# EAGLE design Clock_rev1 (EAGLE 9.6.2)
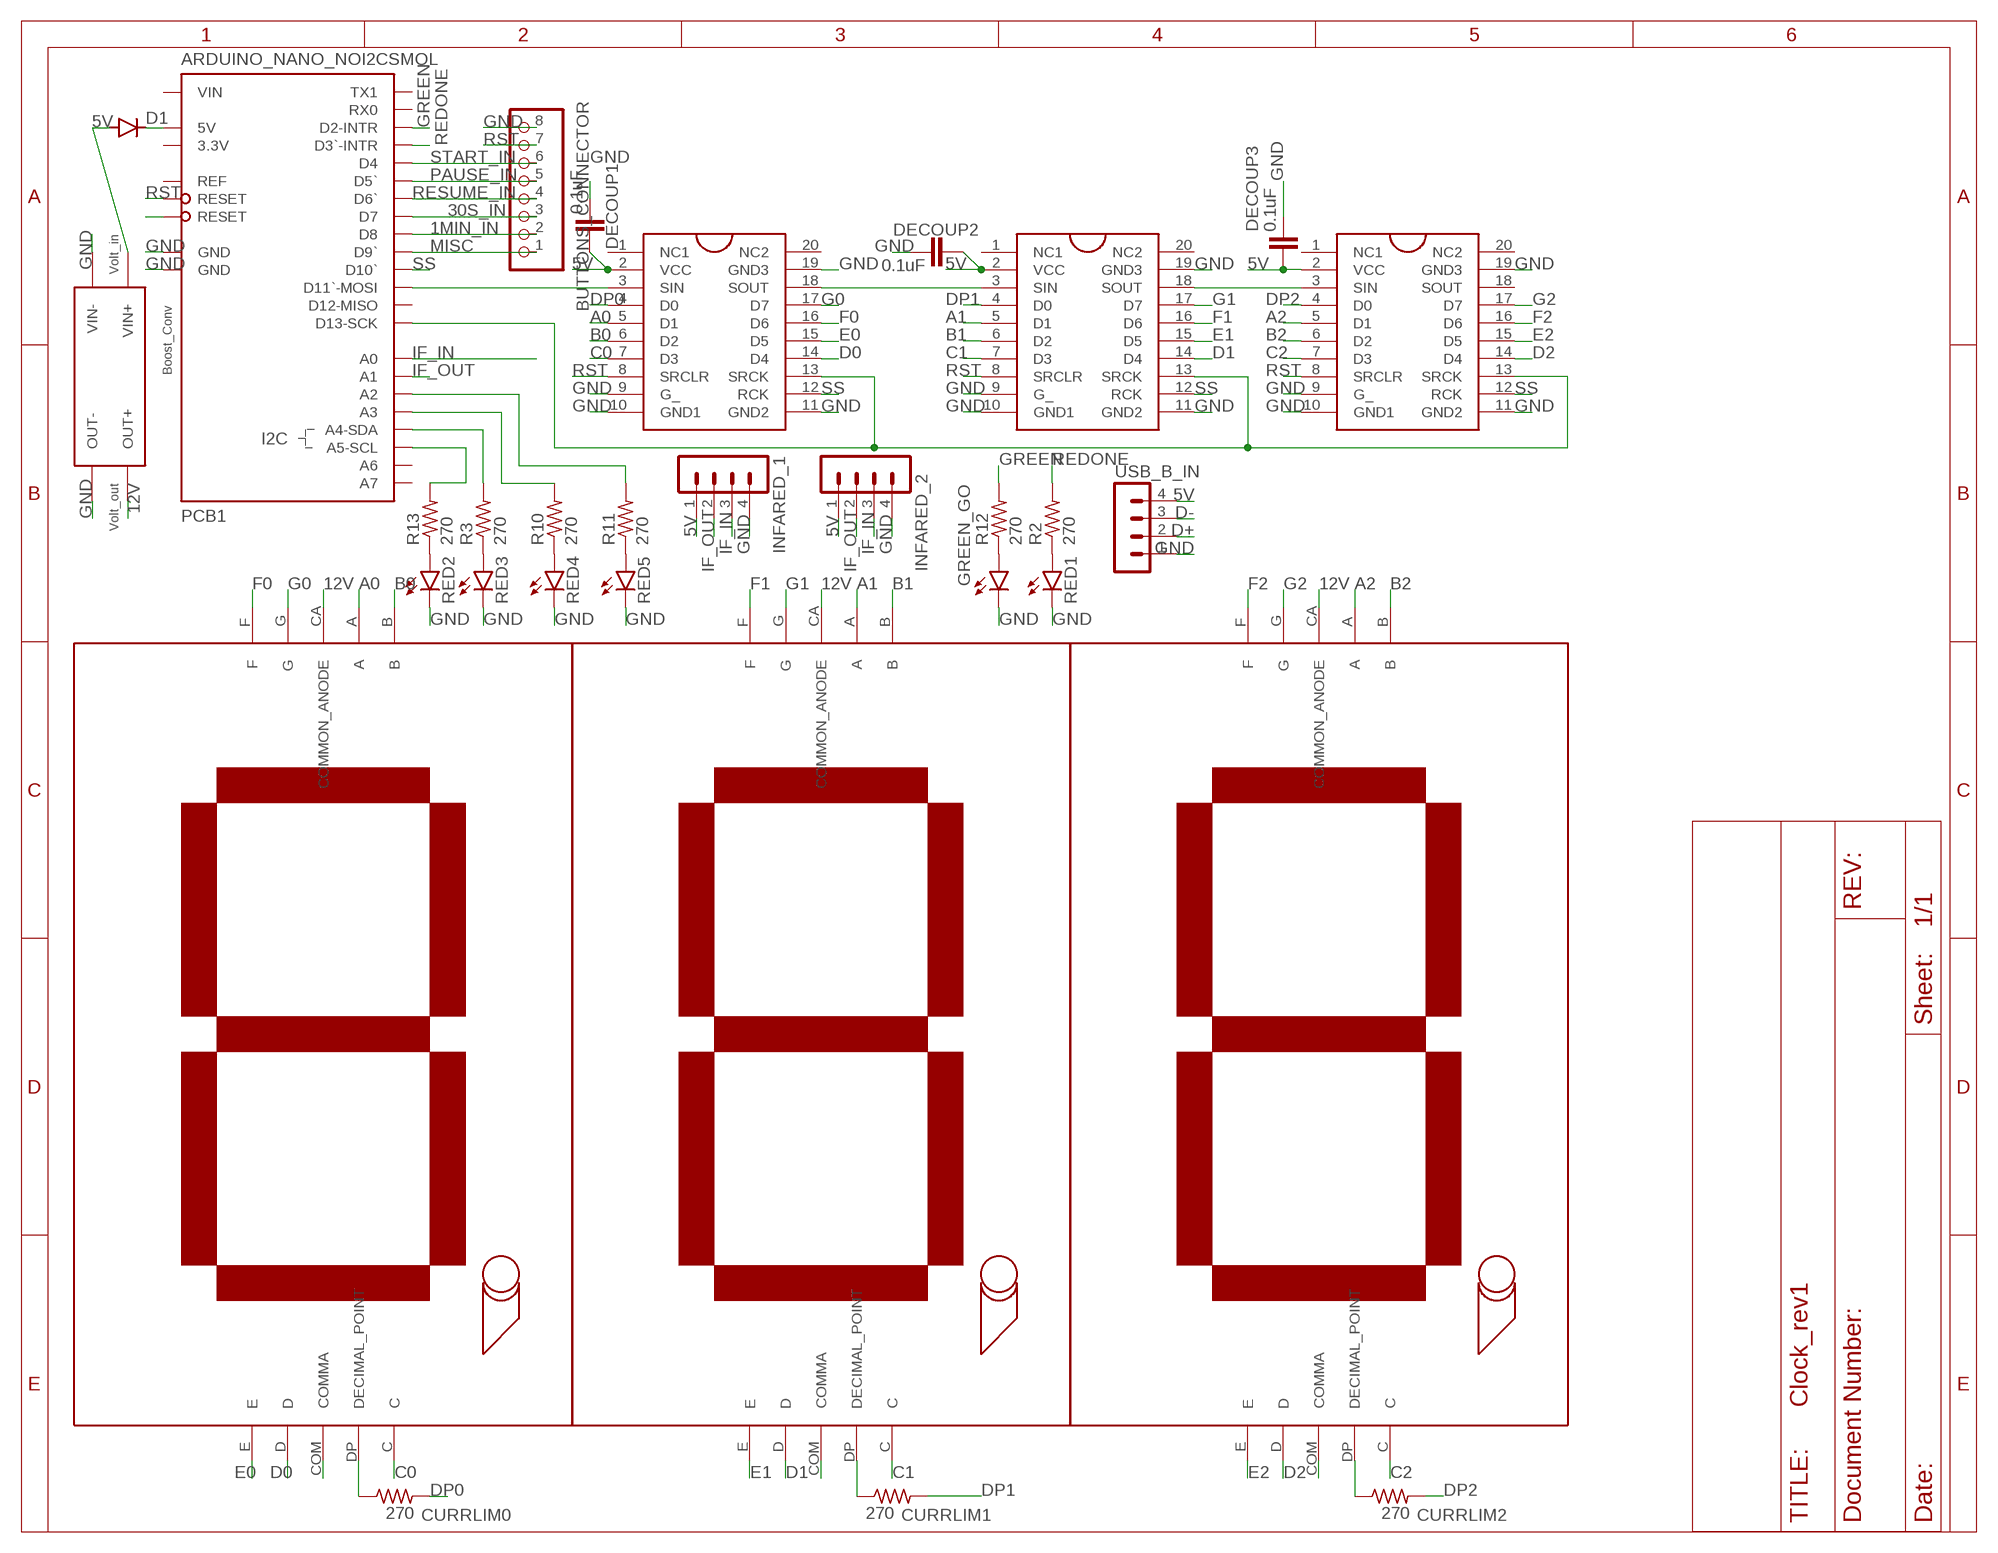
[diagram p0: schematic, sheet 1]

## Parts
BUTTONS_CONNECTOR  PINHD-1X8/90  [1X08/90]
CURRLIM0  270  R-US_0207/10  [0207/10]
CURRLIM1  270  R-US_0207/10  [0207/10]
CURRLIM2  270  R-US_0207/10  [0207/10]
D1  1N4148DO35-7  [DO35-7]
DECOUP1  0.1uF  C2.5/2  [C2.5-2]
DECOUP2  0.1uF  C2.5/2  [C2.5-2]
DECOUP3  0.1uF  C2.5/2  [C2.5-2]
GREEN_GO  LED5MM  [LED5MM]
INFARED_1  MA04-1  [MA04-1]
INFARED_2  MA04-1  [MA04-1]
MINUTES  7SEG_LED_A-3001SR  [7SEG_LED]
PCB1  ARDUINO_NANO_NOI2CSMOL  [ARDUINO_NANO_SMOL]
R2  270  R-US_0207/10  [0207/10]
R3  270  R-US_0207/10  [0207/10]
R10  270  R-US_0207/10  [0207/10]
R11  270  R-US_0207/10  [0207/10]
R12  270  R-US_0207/10  [0207/10]
R13  270  R-US_0207/10  [0207/10]
RED1  LED5MM  [LED5MM]
RED2  LED5MM  [LED5MM]
RED3  LED5MM  [LED5MM]
RED4  LED5MM  [LED5MM]
RED5  LED5MM  [LED5MM]
SECONDS_ONES  7SEG_LED_A-3001SR  [7SEG_LED]
SECONDS_TENS  7SEG_LED_A-3001SR  [7SEG_LED]
SP0  SHIFT_REGISTER_TPIC6C595  [SHIFT_REGISTER]
SP1  SHIFT_REGISTER_TPIC6C595  [SHIFT_REGISTER]
SP2  SHIFT_REGISTER_TPIC6C595  [SHIFT_REGISTER]
U$4  BOOST_CONV  [BOOST_CONV]
USB_B_IN  MA04-1  [MA04-1]

## Nets
1MIN_IN: BUTTONS_CONNECTOR.2 PCB1.D8
5V: D1.A DECOUP1.2 DECOUP2.2 DECOUP3.2 INFARED_1.1 INFARED_2.1 SP0.2(VCC) SP1.2(VCC) SP2.2(VCC) U$4.P$2(VIN+) USB_B_IN.4
12V: MINUTES.CA(COMMON_ANODE) SECONDS_ONES.CA(COMMON_ANODE) SECONDS_TENS.CA(COMMON_ANODE) U$4.P$3(OUT+)
30S_IN: BUTTONS_CONNECTOR.3 PCB1.D7
A0: MINUTES.A SP0.5(D1)
A1: SECONDS_TENS.A SP1.5(D1)
A2: SECONDS_ONES.A SP2.5(D1)
B0: MINUTES.B SP0.6(D2)
B1: SECONDS_TENS.B SP1.6(D2)
B2: SECONDS_ONES.B SP2.6(D2)
C0: MINUTES.C SP0.7(D3)
C1: SECONDS_TENS.C SP1.7(D3)
C2: SECONDS_ONES.C SP2.7(D3)
D0: MINUTES.D SP0.14(D4)
D1: SECONDS_TENS.D SP1.14(D4)
D2: SECONDS_ONES.D SP2.14(D4)
D+: USB_B_IN.2
D-: USB_B_IN.3
DP0: CURRLIM0.2 SP0.4(D0)
DP1: CURRLIM1.2 SP1.4(D0)
DP2: CURRLIM2.2 SP2.4(D0)
E0: MINUTES.E SP0.15(D5)
E1: SECONDS_TENS.E SP1.15(D5)
E2: SECONDS_ONES.E SP2.15(D5)
F0: MINUTES.F SP0.16(D6)
F1: SECONDS_TENS.F SP1.16(D6)
F2: SECONDS_ONES.F SP2.16(D6)
G0: MINUTES.G SP0.17(D7)
G1: SECONDS_TENS.G SP1.17(D7)
G2: SECONDS_ONES.G SP2.17(D7)
GND: BUTTONS_CONNECTOR.8 DECOUP1.1 DECOUP2.1 DECOUP3.1 GREEN_GO.K(C) INFARED_1.4 INFARED_2.4 PCB1.GND PCB1.GND@2(GND) RED1.K(C) RED2.K(C) RED3.K(C) RED4.K(C) RED5.K(C) SP0.9(G_) SP0.10(GND1) SP0.11(GND2) SP0.19(GND3) SP1.9(G_) SP1.10(GND1) SP1.11(GND2) SP1.19(GND3) SP2.9(G_) SP2.10(GND1) SP2.11(GND2) SP2.19(GND3) U$4.P$1(VIN-) U$4.P$4(OUT-) USB_B_IN.1
GREEN: PCB1.D2(D2-INTR) R12.2
IF_IN: INFARED_1.3 INFARED_2.3 PCB1.A0
IF_OUT: INFARED_1.2 INFARED_2.2 PCB1.A1
MISC: BUTTONS_CONNECTOR.1 PCB1.D9(D9`)
N$1: PCB1.D11(D11`-MOSI) SP0.3(SIN)
N$2: D1.C PCB1.5V
N$3: CURRLIM0.1 MINUTES.DP(DECIMAL_POINT)
N$4: CURRLIM1.1 SECONDS_TENS.DP(DECIMAL_POINT)
N$5: CURRLIM2.1 SECONDS_ONES.DP(DECIMAL_POINT)
N$6: SP0.18(SOUT) SP1.3(SIN)
N$7: SP1.18(SOUT) SP2.3(SIN)
N$8: PCB1.D13(D13-SCK) SP0.13(SRCK) SP1.13(SRCK) SP2.13(SRCK)
N$9: PCB1.RESET@2(RESET)
N$11: R2.1 RED1.A
N$12: R13.1 RED2.A
N$13: R3.1 RED3.A
N$14: R10.1 RED4.A
N$15: R11.1 RED5.A
N$16: GREEN_GO.A R12.1
N$19: PCB1.A5(A5-SCL) R13.2
N$20: PCB1.A4(A4-SDA) R3.2
N$21: PCB1.A3 R10.2
N$22: PCB1.A2 R11.2
N$36: SECONDS_ONES.COM(COMMA)
N$40: SECONDS_TENS.COM(COMMA)
N$44: MINUTES.COM(COMMA)
PAUSE_IN: BUTTONS_CONNECTOR.5 PCB1.D5(D5`)
REDONE: PCB1.D3(D3`-INTR) R2.2
RESUME_IN: BUTTONS_CONNECTOR.4 PCB1.D6(D6`)
RST: BUTTONS_CONNECTOR.7 PCB1.RESET SP0.8(SRCLR) SP1.8(SRCLR) SP2.8(SRCLR)
SS: PCB1.D10(D10`) SP0.12(RCK) SP1.12(RCK) SP2.12(RCK)
START_IN: BUTTONS_CONNECTOR.6 PCB1.D4
Unconnected: PCB1.3V3(3.3V) PCB1.A6 PCB1.A7 PCB1.D12(D12-MISO) PCB1.REF PCB1.RX0 PCB1.TX1 PCB1.VIN SP0.1(NC1) SP0.20(NC2) SP1.1(NC1) SP1.20(NC2) SP2.1(NC1) SP2.18(SOUT) SP2.20(NC2)

## Library data of the parts
BUTTONS_CONNECTOR = pinhead:PINHD-1X8: PIN HEADER
CURRLIM0 CURRLIM1 CURRLIM2 R2 R3 R10-R13 = BJH_LIB:R-US_: RESISTOR, American symbol; SPICEPREFIX: R
D1 = diode:1N4148: DIODE high speed (Philips)
DECOUP1-DECOUP3 = capacitor-wima:C: CAPACITOR naming: grid - package width
GREEN_GO RED1-RED5 = led:LED: LED OSRAM: - CHIPLED LG R971, LG N971, LY N971, LG Q971, LY Q971, LO R971, LY R971 LH N974, LH R974 LS Q976, LO Q976, LY Q976 LO Q996 - Hyper CHIPLED LW Q18S LB Q993, LB Q99A, LB R99A - SideLED LS A670, LO A670, LY A670, LG A670, LP A670 LB A673, LV A673, LT A673, LW A673 LH A674 LY A675 LS A676, LA A676, LO A676, LY A676, LW A676 LS A679, LY A679, LG A679 - Hyper Micro SIDELED® LS Y876, LA Y876, LO Y876, LY Y876 LT Y87S - SmartLED LW L88C, LW L88S LB L89C, LB L89S, LG L890 LS L89K, LO L89K, LY L89K LS L896, LA L896, LO L896, LY L896 - TOPLED LS T670, LO T670, LY T670, LG T670, LP T670 LSG T670, LSP T670, LSY T670, LOP T670, LYG T670 LG T671, LOG T671, LSG T671 LB T673, LV T673, LT T673, LW T673 LH T674 LS T676, LA T676, LO T676, LY T676, LB T676, LH T676, LSB T676, LW T676 LB T67C, LV T67C, LT T67C, LS T67K, LO T67K, LY T67K, LW E67C LS E67B, LA E67B, LO E67B, LY E67B, LB E67C, LV E67C, LT E67C LW T67C LS T679, LY T679, LG T679 LS T770, LO T770, LY T770, LG T770, LP T770 LB T773, LV T773, LT T773, LW T773 LH T774 LS E675, LA E675, LY E675, LS T675 LS T776, LA T776, LO T776, LY T776, LB T776 LHGB T686 LT T68C, LB T68C - Hyper Mini TOPLED® LB M676 - Mini TOPLED Santana® LG M470 LS M47K, LO M47K, LY M47K Source: http://www.osram.convergy.de LUXEON: - LUMILED® LXK2-PW12-R00, LXK2-PW12-S00, LXK2-PW14-U00, LXK2-PW14-V00 LXK2-PM12-R00, LXK2-PM12-S00, LXK2-PM14-U00 LXK2-PE12-Q00, LXK2-PE12-R00, LXK2-PE12-S00, LXK2-PE14-T00, LXK2-PE14-U00 LXK2-PB12-K00, LXK2-PB12-L00, LXK2-PB12-M00, LXK2-PB14-N00, LXK2-PB14-P00, LXK2-PB14-Q00 LXK2-PR12-L00, LXK2-PR12-M00, LXK2-PR14-Q00, LXK2-PR14-R00 LXK2-PD12-Q00, LXK2-PD12-R00, LXK2-PD12-S00 LXK2-PH12-R00, LXK2-PH12-S00 LXK2-PL12-P00, LXK2-PL12-Q00, LXK2-PL12-R00 Source: www.luxeon.com KINGBRIGHT: KA-3528ASYC Source: www.kingbright.com
INFARED_1 INFARED_2 USB_B_IN = con-lstb:MA04-1: PIN HEADER; OC_FARNELL: unknown; OC_NEWARK: unknown
MINUTES SECONDS_ONES SECONDS_TENS = ARC_Clock:7SEG_LED_A-3001SR
PCB1 = ElcPartsLibrary:ARDUINO_NANO_NOI2C
SP0 SP1 SP2 = ARC_Clock:SHIFT_REGISTER_TPIC6C595
U$4 = BJH_LIB:BOOST_CONV

## Board
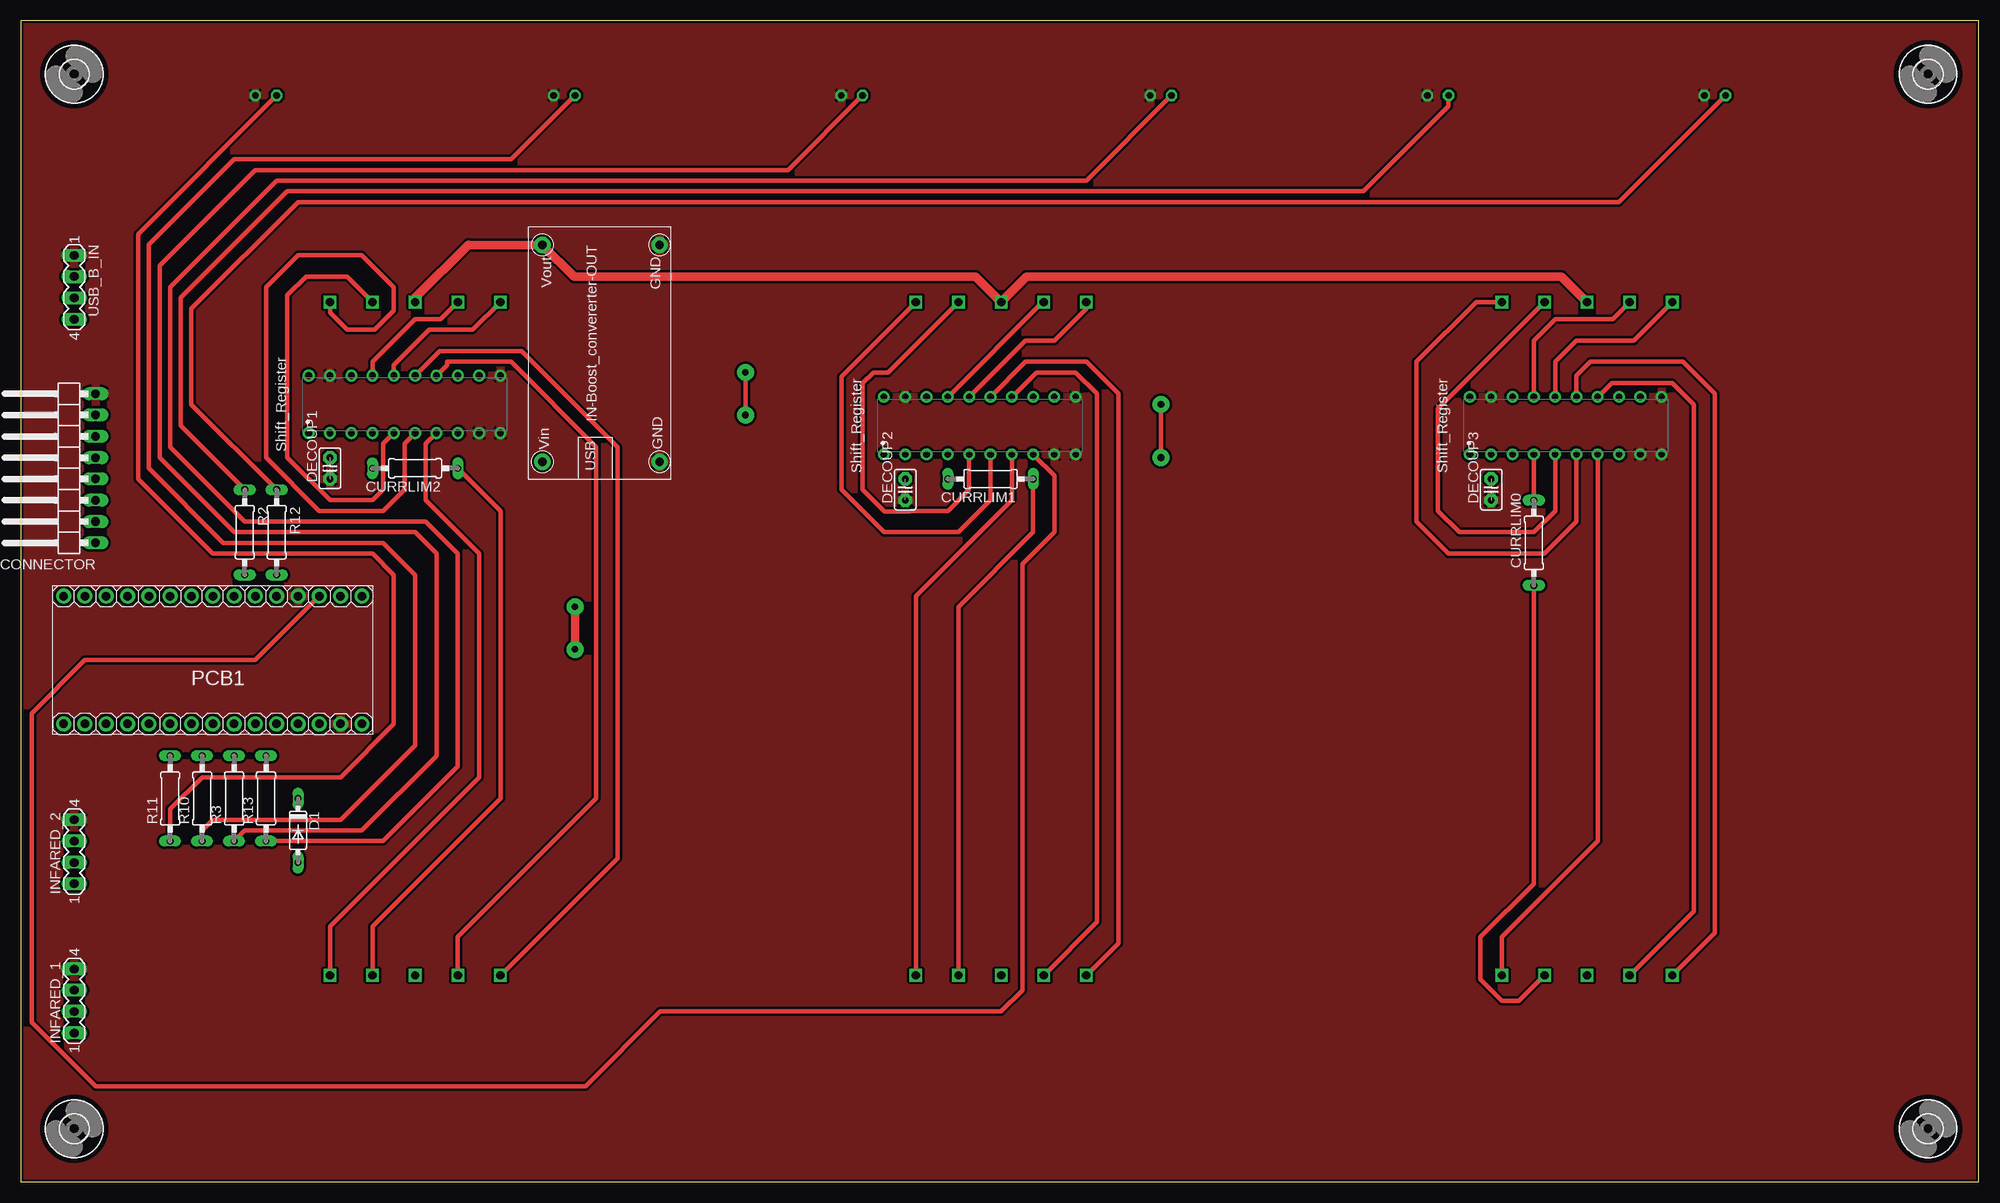
[diagram p1: board, top side]
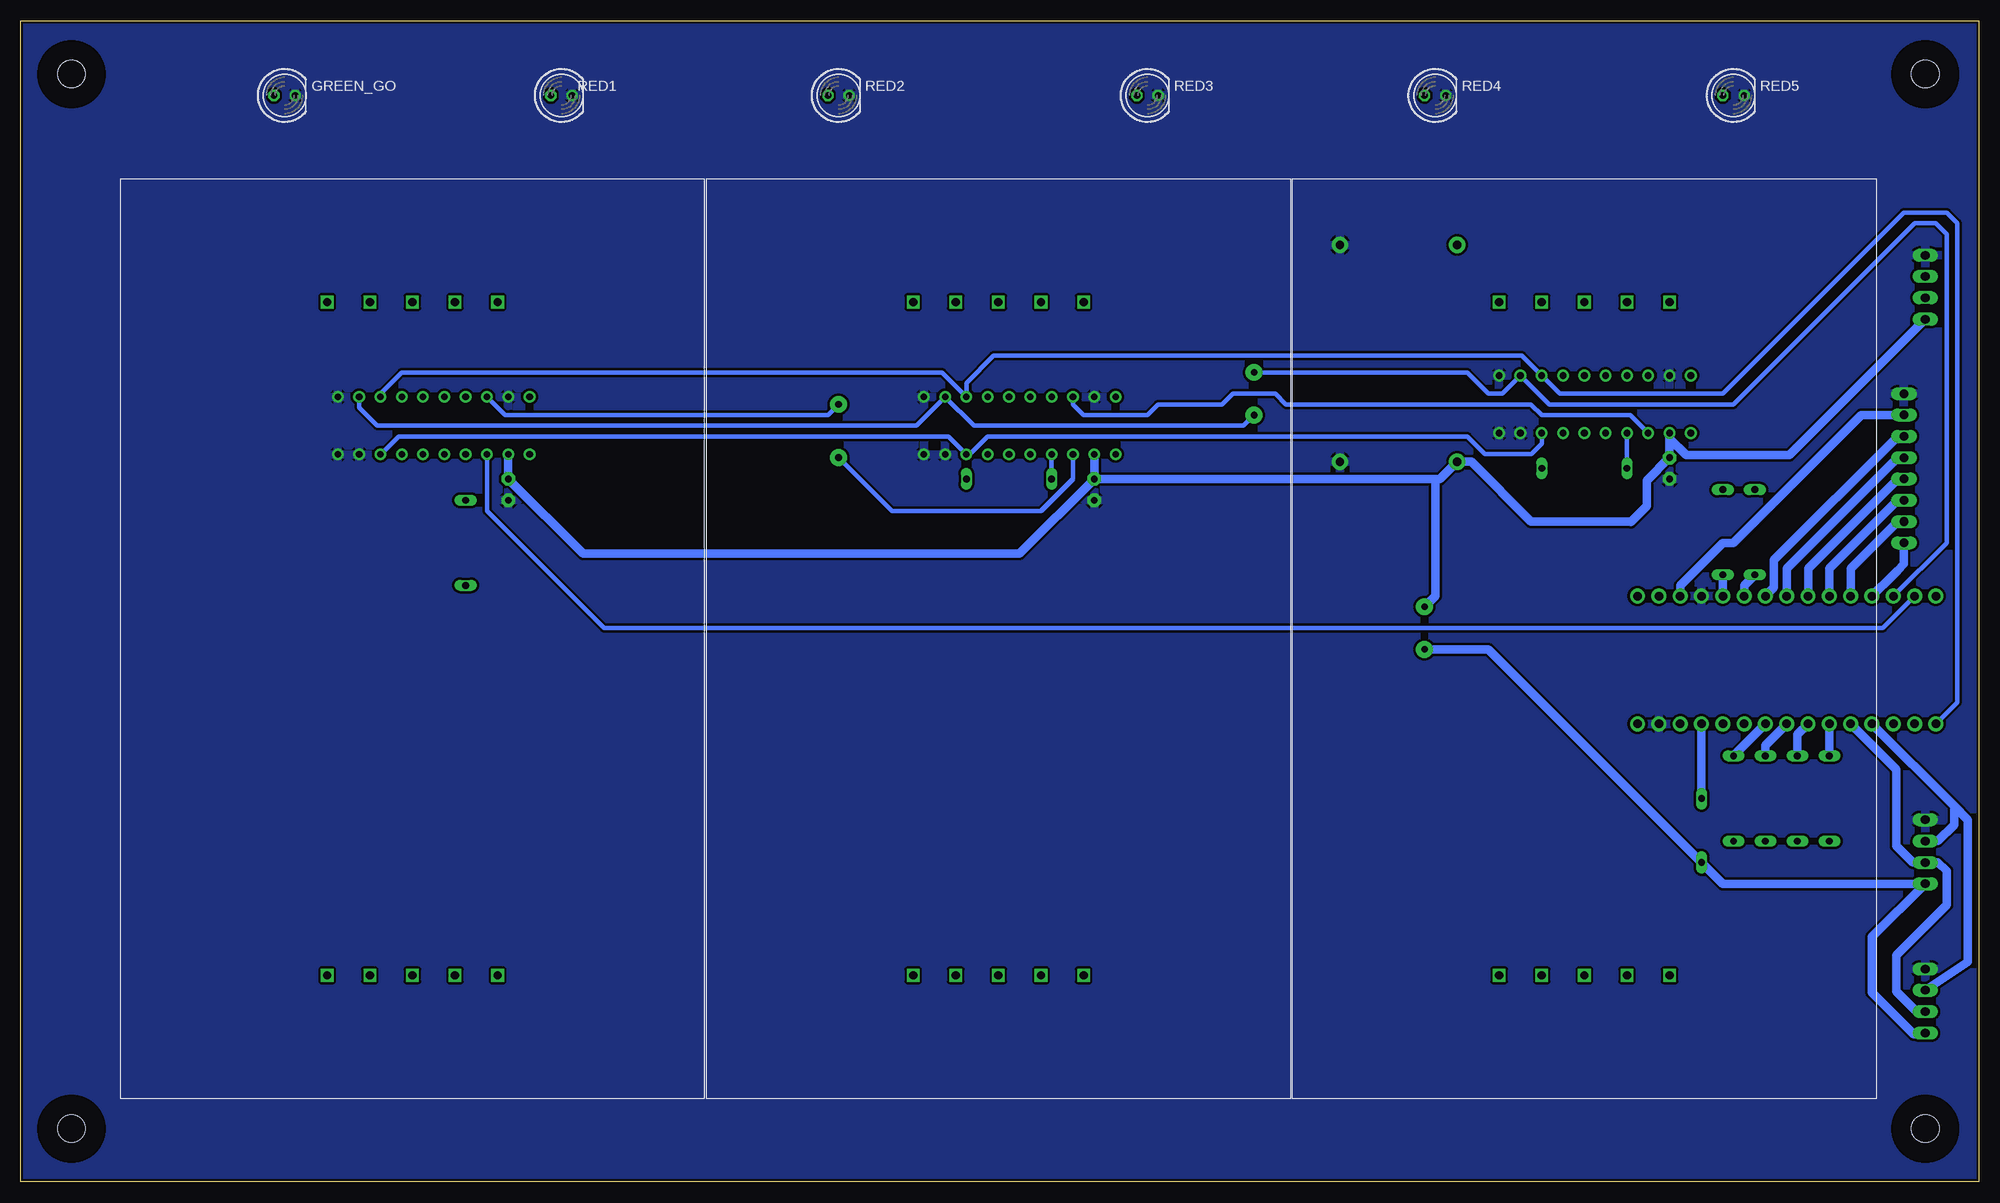
[diagram p2: board, bottom side, seen from below]

Size 233.35 x 138.42 mm. Coordinates in mm from the lower left corner, seen from the top.
Outline: 0,0 233.35,0 233.35,138.42 0,138.42 0,0
Copper layers (1*16): Top 0.035mm / dielectric 1.5mm / Bottom 0.035mm
Design rules "DRC_Advanced *": minimum track width 12mil, minimum drill 0.3mm, track to track 12mil, track to pad 12mil, pad to pad 12mil, via to via 12mil, smd to smd 6mil, copper to edge 12mil, drill to drill 12mil, minimum pad ring 10mil, minimum via ring 8mil, stop-mask expansion 4mil, vias tented up to drill 0mil, thermal gap 12mil

### Footprints (pad centres in the part's own frame; a part is rotated, then mirrored left to right if it is on the bottom)
1X08/90 = drill 1.016 long: 1 -8.89,-3.81; 2 -6.35,-3.81; 3 -3.81,-3.81; 4 -1.27,-3.81; 5 1.27,-3.81; 6 3.81,-3.81; 7 6.35,-3.81; 8 8.89,-3.81
0207/10 = drill 0.813 long: 1 -5.08,0; 2 5.08,0
DO35-7 = drill 0.813 long: A 3.81,0; C -3.81,0
C2.5-2 = drill 0.813 pad 1.6 octagon: 1 -1.27,0; 2 1.27,0
LED5MM = drill 0.813 octagon: A -1.27,0; K 1.27,0
MA04-1 = drill 1.016 long: 1 -3.81,0; 2 -1.27,0; 3 1.27,0; 4 3.81,0
7SEG_LED = drill 1 square: A 5.08,40.132; B 10.16,40.132; C 10.16,-40.132; CA 0,40.132; COM 0,-40.132; D -5.08,-40.132; DP 5.08,-40.132; E -10.16,-40.132; F -10.16,40.132; G -5.08,40.132
ARDUINO_NANO_SMOL = drill 1.016 pad 1.778: 3V3 -13.97,-7.62; 5V 11.43,-7.62; A0 -8.89,-7.62; A1 -6.35,-7.62; A2 -3.81,-7.62; A3 -1.27,-7.62; A4 1.27,-7.62; A5 3.81,-7.62; A6 6.35,-7.62; A7 8.89,-7.62; D2 8.89,7.62; D3 6.35,7.62; D4 3.81,7.62; D5 1.27,7.62; D6 -1.27,7.62; D7 -3.81,7.62; D8 -6.35,7.62; D9 -8.89,7.62; D10 -11.43,7.62; D11 -13.97,7.62; D12 -16.51,7.62; D13 -16.51,-7.62; GND 11.43,7.62; GND@2 16.51,-7.62; REF -11.43,-7.62; RESET 13.97,7.62; RESET@2 13.97,-7.62; RX0 16.51,7.62; TX1 19.05,7.62; VIN 19.05,-7.62
SHIFT_REGISTER = drill 0.788 pad 1.388: 1 -3.429,11.43; 2 -3.429,8.89; 3 -3.429,6.35; 4 -3.429,3.81; 5 -3.429,1.27; 6 -3.429,-1.27; 7 -3.429,-3.81; 8 -3.429,-6.35; 9 -3.429,-8.89; 10 -3.429,-11.43; 11 3.429,-11.43; 12 3.429,-8.89; 13 3.429,-6.35; 14 3.429,-3.81; 15 3.429,-1.27; 16 3.429,1.27; 17 3.429,3.81; 18 3.429,6.35; 19 3.429,8.89; 20 3.429,11.43
3,3 = hole 3.3: 0,0
BOOST_CONV = drill 1 pad 1.93: P$1 2.05,1.35; P$2 2.05,15.32; P$3 27.9,15.32; P$4 27.9,1.35

### Placement (x,y rotation side)
BUTTONS_CONNECTOR  5.08,85.09 90 top
CURRLIM0  180.34,76.2 90 top
CURRLIM1  115.57,83.82 180 top
CURRLIM2  46.99,85.09 180 top
D1  33.02,41.91 270 top
DECOUP1  36.83,85.09 90 top
DECOUP2  105.41,82.55 90 top
DECOUP3  175.26,82.55 90 top
GREEN_GO  201.93,129.54 0 bottom
INFARED_1  6.35,21.59 90 top
INFARED_2  6.35,39.37 90 top
MINUTES  186.69,64.77 0 bottom
PCB1  21.59,62.23 0 top
R2  26.67,77.47 270 top
R3  25.4,45.72 90 top
R10  21.59,45.72 90 top
R11  17.78,45.72 90 top
R12  30.48,77.47 270 top
R13  29.21,45.72 90 top
RED1  168.91,129.54 0 bottom
RED2  135.89,129.54 0 bottom
RED3  99.06,129.54 0 bottom
RED4  64.77,129.54 0 bottom
RED5  29.21,129.54 0 bottom
SECONDS_ONES  46.99,64.77 0 bottom
SECONDS_TENS  116.84,64.77 0 bottom
SP0  184.15,90.17 90 top
SP1  114.3,90.17 90 top
SP2  45.72,92.71 90 top
U$1  [3,3]  6.35,132.08 0 top
U$2  [3,3]  6.35,6.35 0 top
U$3  [3,3]  227.33,132.08 0 top
U$4  77.47,83.82 90 top
U$5  [3,3]  227.33,6.35 0 top
USB_B_IN  6.35,106.68 270 top

### Tracks (layer width: path | path; a pad name or v marks a point on that pad's centre or on a via)
1MIN_IN
  Bottom 1.016: PCB1.D8 15.24,73.15 9.65,78.74 BUTTONS_CONNECTOR.2
5V  (via drill 0.8 pad 2)
  Top 1.016: v66.04,68.58 v66.04,63.5
  Bottom 1.016: USB_B_IN.4 22.56,86.66 34.85,86.66 36.83,88.64 SP2.2 DECOUP1.2 39.56,83.63 39.56,80.58 41.47,78.68 41.66,78.74 53.34,78.74 60.47,85.87 U$4.P$2 64.2,83.82 64.77,83.82 | 64.77,83.82 DECOUP2.2 | DECOUP2.2 SP1.2 | SP0.2 DECOUP3.2 166.37,74.93 114.3,74.93 DECOUP2.2 | INFARED_1.1 6.5,17.63 7.7,17.63 12.7,22.63 12.7,29.21 INFARED_2.1 8.89,35.56 30.48,35.56 D1.A 58.42,63.5 v66.04,63.5 | v66.04,68.58 64.77,69.85 64.77,83.82
12V
  Top 1.016: SECONDS_ONES.CA 46.99,105.41 53.34,111.76 53.38,111.72 U$4.P$3 65.92,107.95 113.79,107.95 SECONDS_TENS.CA 119.89,107.95 183.64,107.95 MINUTES.CA
30S_IN
  Bottom 1.016: PCB1.D7 17.78,73.15 9.65,81.28 BUTTONS_CONNECTOR.3
A0
  Top 0.508: MINUTES.A 168.91,92.2 168.91,80.01 171.45,77.47 180.34,77.47 182.88,80.01 SP0.5
A1
  Top 0.508: SECONDS_TENS.A 103.38,96.52 101.6,96.52 100.33,95.25 100.33,82.55 102.96,79.92 105.97,79.92 106.06,80.01 110.49,80.01 113.03,82.55 SP1.5
A2
  Top 0.508: SECONDS_ONES.A 38.86,107.95 33.98,107.95 31.75,105.72 31.75,86.36 36.83,81.28 41.91,81.28 43.18,82.55 43.18,88.01 SP2.5
B0
  Top 0.508: MINUTES.B 173.48,104.9 166.37,97.79 166.37,78.74 170.18,74.93 181.61,74.93 185.42,78.74 SP0.6
B1
  Top 0.508: SECONDS_TENS.B 97.79,96.01 97.79,82.55 102.87,77.47 111.76,77.47 115.57,81.28 SP1.6
B2
  Top 0.508: SECONDS_ONES.B 36.83,103.63 38.86,101.6 42.18,101.6 44.45,103.87 44.45,106.68 40.64,110.49 33.02,110.49 29.21,106.68 29.21,86.36 35.56,80.01 43.18,80.01 45.72,82.55 45.72,88.01 SP2.6
C0
  Top 0.508: MINUTES.C 176.53,29.21 187.96,40.64 SP0.7
C1
  Top 0.508: SP1.7 118.11,81.28 106.68,69.85 SECONDS_TENS.C
C2
  Top 0.508: SP2.7 48.26,88.01 48.26,81.28 54.61,74.93 54.61,48.26 36.83,30.48 SECONDS_ONES.C
D0
  Top 0.508: SP0.14 189.61,95.25 196.85,95.25 199.39,92.71 199.39,32.26 MINUTES.D
D1
  Top 0.508: SP1.14 121.03,96.52 125.73,96.52 128.27,93.98 128.27,30.99 SECONDS_TENS.D
D2
  Top 0.508: SP2.14 50.8,97.41 50.8,97.79 58.42,97.79 68.58,87.63 68.58,45.72 52.07,29.21 SECONDS_ONES.D
DP0
  Top 0.508: CURRLIM0.2 SP0.4
DP1
  Bottom 0.508: CURRLIM1.2 SP1.4
DP2
  Bottom 0.508: SP2.4 CURRLIM2.2
E0
  Top 0.508: SP0.15 185.42,96.14 187.07,97.79 198.12,97.79 201.93,93.98 201.93,29.72 MINUTES.E
E1
  Top 0.508: SP1.15 119.76,97.79 127,97.79 130.81,93.98 130.81,28.45 SECONDS_TENS.E
E2
  Top 0.508: SP2.15 49.91,99.06 59.69,99.06 71.12,87.63 71.12,38.61 SECONDS_ONES.E
F0
  Top 0.508: MINUTES.F 192.28,100.33 185.42,100.33 182.88,97.79 SP0.16
F1
  Top 0.508: SP1.16 119.76,100.33 123.19,100.33 127,104.14 SECONDS_TENS.F
F2
  Top 0.508: SP2.16 44.45,97.41 48.64,101.6 53.85,101.6 SECONDS_ONES.F
G0
  Top 0.508: MINUTES.G 189.74,102.87 182.88,102.87 180.34,100.33 SP0.17
G1
  Top 0.508: SP1.17 121.79,104.9 SECONDS_TENS.G
G2
  Top 0.508: SECONDS_ONES.G 50.04,102.87 46.99,102.87 41.91,97.79 SP2.17
GND
  pour Top: -3.81,143.51 234.95,143.51 236.22,142.24 236.22,-1.27 232.41,-5.08 -3.68,-5.08 -8.64,138.68
  pour Bottom: -3.81,144.78 232.41,144.78 238.76,138.43 238.76,-1.27 231.14,-8.89 0,-8.89 -7.62,-1.27 -7.62,140.97
GREEN
  Bottom 1.016: R12.2 PCB1.D2
IF_IN
  Bottom 1.016: INFARED_2.3 4.85,40.64 2.9,42.59 2.9,44.81 | PCB1.A0 2.9,44.81 | 2.9,44.81 1.27,43.18 1.27,26.25 INFARED_1.3
IF_OUT
  Bottom 1.016: PCB1.A1 9.8,49.17 9.8,40.05 7.85,38.1 INFARED_2.2 4.85,38.1 3.81,37.06 3.81,33.02 9.8,27.03 9.8,22.71 7.42,20.32 INFARED_1.2
MISC
  Bottom 1.016: PCB1.D9 10.16,72.39 9.65,72.9 8.89,73.66 BUTTONS_CONNECTOR.1
N$1
  Bottom 0.508: SP0.3 177.8,80.01 163.83,66.04 11.43,66.04 PCB1.D11
N$2
  Bottom 1.016: D1.C PCB1.5V
N$3
  Top 0.508: CURRLIM0.1 180.34,35.56 173.99,29.21 173.99,24.13 176.53,21.59 178.56,21.59 MINUTES.DP
N$4
  Top 0.508: CURRLIM1.1 120.65,77.47 111.76,68.58 SECONDS_TENS.DP
N$5
  Top 0.508: CURRLIM2.1 57.15,80.01 57.15,45.72 41.91,30.48 SECONDS_ONES.DP
N$6  (via drill 0.8 pad 2)
  Top 0.508: v135.89,92.71 v135.89,86.36
  Bottom 0.508: 107.95,83.82 SP1.3 | 111.76,80.01 129.54,80.01 v135.89,86.36 | SP0.18 175.64,91.44 137.16,91.44 v135.89,92.71
  Bottom 0.61: 107.95,83.82 111.76,80.01
N$7
  Bottom 0.508: SP1.18 107.95,92.71 106.68,91.44 99.06,91.44 97.79,92.71 90.17,92.71 88.9,93.98 83.82,93.98 82.55,92.71 53.34,92.71 52.07,91.44 41.53,91.44 SP2.3
N$8
  Bottom 0.508: SP0.13 190.5,93.98 187.96,96.52 123.57,96.52 SP1.13 120.65,95.25 117.39,98.51 54.44,98.51 SP2.13 49.91,93.98 30.48,93.98 8.89,115.57 3.81,115.57 2.54,114.3 2.54,57.15 PCB1.D13
N$11
  Top 0.508: R2.1 19.05,90.17 19.05,105.41 31.75,118.11 160.02,118.11 170.18,128.27 RED1.A
N$12
  Top 0.508: RED2.A 127,119.38 30.48,119.38 17.78,106.68 17.78,87.63 26.67,78.74 48.26,78.74 52.07,74.93 52.07,49.53 43.18,40.64 R13.1
N$13
  Top 0.508: RED3.A 91.44,120.65 27.94,120.65 16.51,109.22 16.51,86.36 25.4,77.47 46.99,77.47 49.53,74.93 49.53,50.8 40.64,41.91 26.67,41.91 R3.1
N$14
  Top 0.508: RED4.A 58.42,121.92 25.4,121.92 15.24,111.76 15.24,85.09 24.13,76.2 43.18,76.2 46.99,72.39 46.99,52.07 38.1,43.18 22.86,43.18 21.59,41.91 R10.1
N$15
  Top 0.508: RED5.A 13.97,113.03 13.97,83.82 22.86,74.93 41.91,74.93 44.45,72.39 44.45,54.61 38.1,48.26 21.59,48.26 17.78,44.45 R11.1
N$16
  Top 0.508: R12.1 20.32,92.71 20.32,104.14 33.02,116.84 190.5,116.84 GREEN_GO.A
N$19
  Bottom 1.016: R13.2 PCB1.A5
N$20
  Bottom 1.016: PCB1.A4 25.4,52.07 R3.2
N$21
  Bottom 1.016: PCB1.A3 21.59,53.34 R10.2
N$22
  Bottom 1.016: PCB1.A2 R11.2
PAUSE_IN
  Bottom 1.016: PCB1.D5 22.86,73.15 9.65,86.36 BUTTONS_CONNECTOR.5
REDONE
  Bottom 1.016: R2.2 27.94,71.12 PCB1.D3
RESUME_IN
  Bottom 1.016: PCB1.D6 20.32,73.15 9.65,83.82 BUTTONS_CONNECTOR.4
RST
  Top 0.508: PCB1.RESET 27.94,62.23 7.62,62.23 1.27,55.88 1.27,19.05 8.89,11.43 67.31,11.43 76.2,20.32 116.84,20.32 119.38,22.86 119.38,73.66 123.19,77.47 123.19,84.2 SP1.8
  Bottom 0.508: SP2.8 52.07,88.01 53.29,86.79 58.85,86.79 60.96,88.9 118.11,88.9 120.65,86.36 120.47,86.56 SP1.8 122.81,88.9 188.34,88.9 SP0.8
  Bottom 1.016: PCB1.RESET 35.56,71.12 30.48,76.2 29.21,76.2 13.97,91.44 BUTTONS_CONNECTOR.7
SS  (via drill 0.8 pad 2)
  Top 0.508: v86.36,96.52 v86.36,91.44
  Bottom 0.508: PCB1.D10 3.81,76.2 3.81,113.03 5.08,114.3 7.62,114.3 29.21,92.71 51.18,92.71 SP2.12 56.77,93.98 58.42,93.98 60.96,96.52 v86.36,96.52 | SP0.12 193.04,92.33 190.88,90.17 126.62,90.17 SP1.12 119.76,90.17 87.63,90.17 v86.36,91.44
START_IN
  Bottom 1.016: PCB1.D4 24.38,70.87 24.38,74.17 9.65,88.9 BUTTONS_CONNECTOR.6